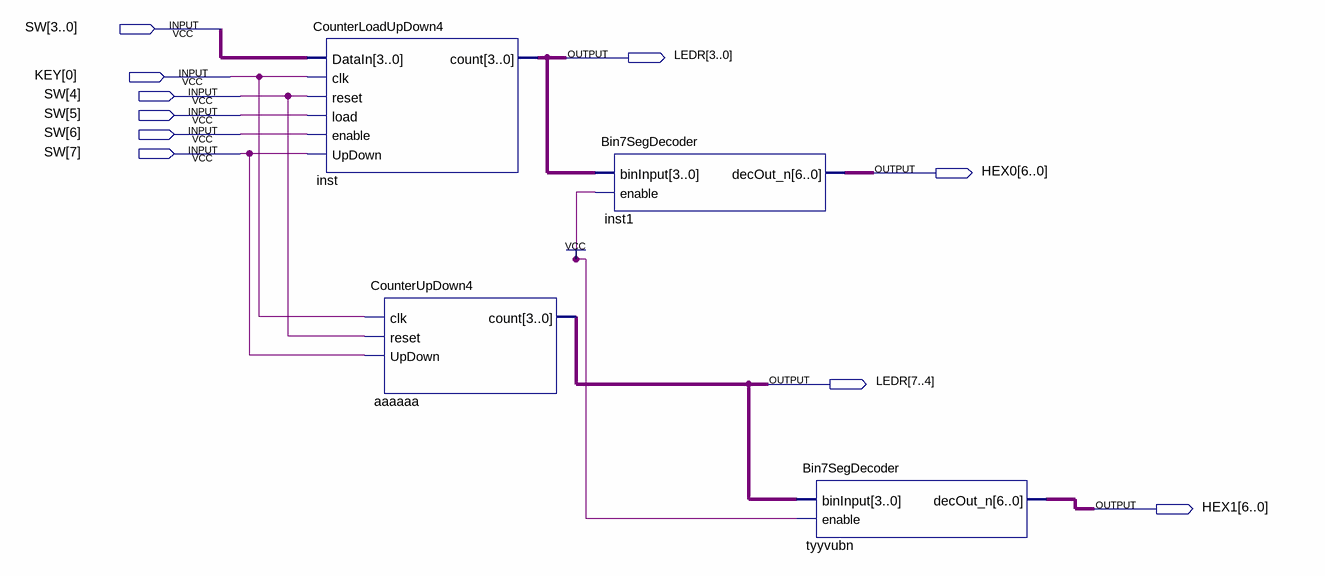
[diagram p0: schematic sheet]
// Quartus schematic Counter_Demo.bdf as structural Verilog: 4 symbols, 10 pins
module Counter_Demo (
  input  [7:0] SW,
  input  [0:0] KEY,
  output [7:0] LEDR,
  output [6:0] HEX0,
  output [6:0] HEX1
);

  CounterLoadUpDown4 inst (
    .DataIn(SW[3:0]), .clk(KEY[0]), .reset(SW[4]), .load(SW[5]), .enable(SW[6]), .UpDown(SW[7]),
    .count(LEDR[3:0]));
  CounterUpDown4 aaaaaa (.clk(KEY[0]), .reset(SW[4]), .UpDown(SW[7]), .count(LEDR[7:4]));
  Bin7SegDecoder inst1 (.binInput(LEDR[3:0]), .enable(1'b1), .decOut_n(HEX0));
  Bin7SegDecoder tyyvubn (.binInput(LEDR[7:4]), .enable(1'b1), .decOut_n(HEX1));
endmodule
